# EAGLE schematic nano_control_station (EAGLE 7.4.0)
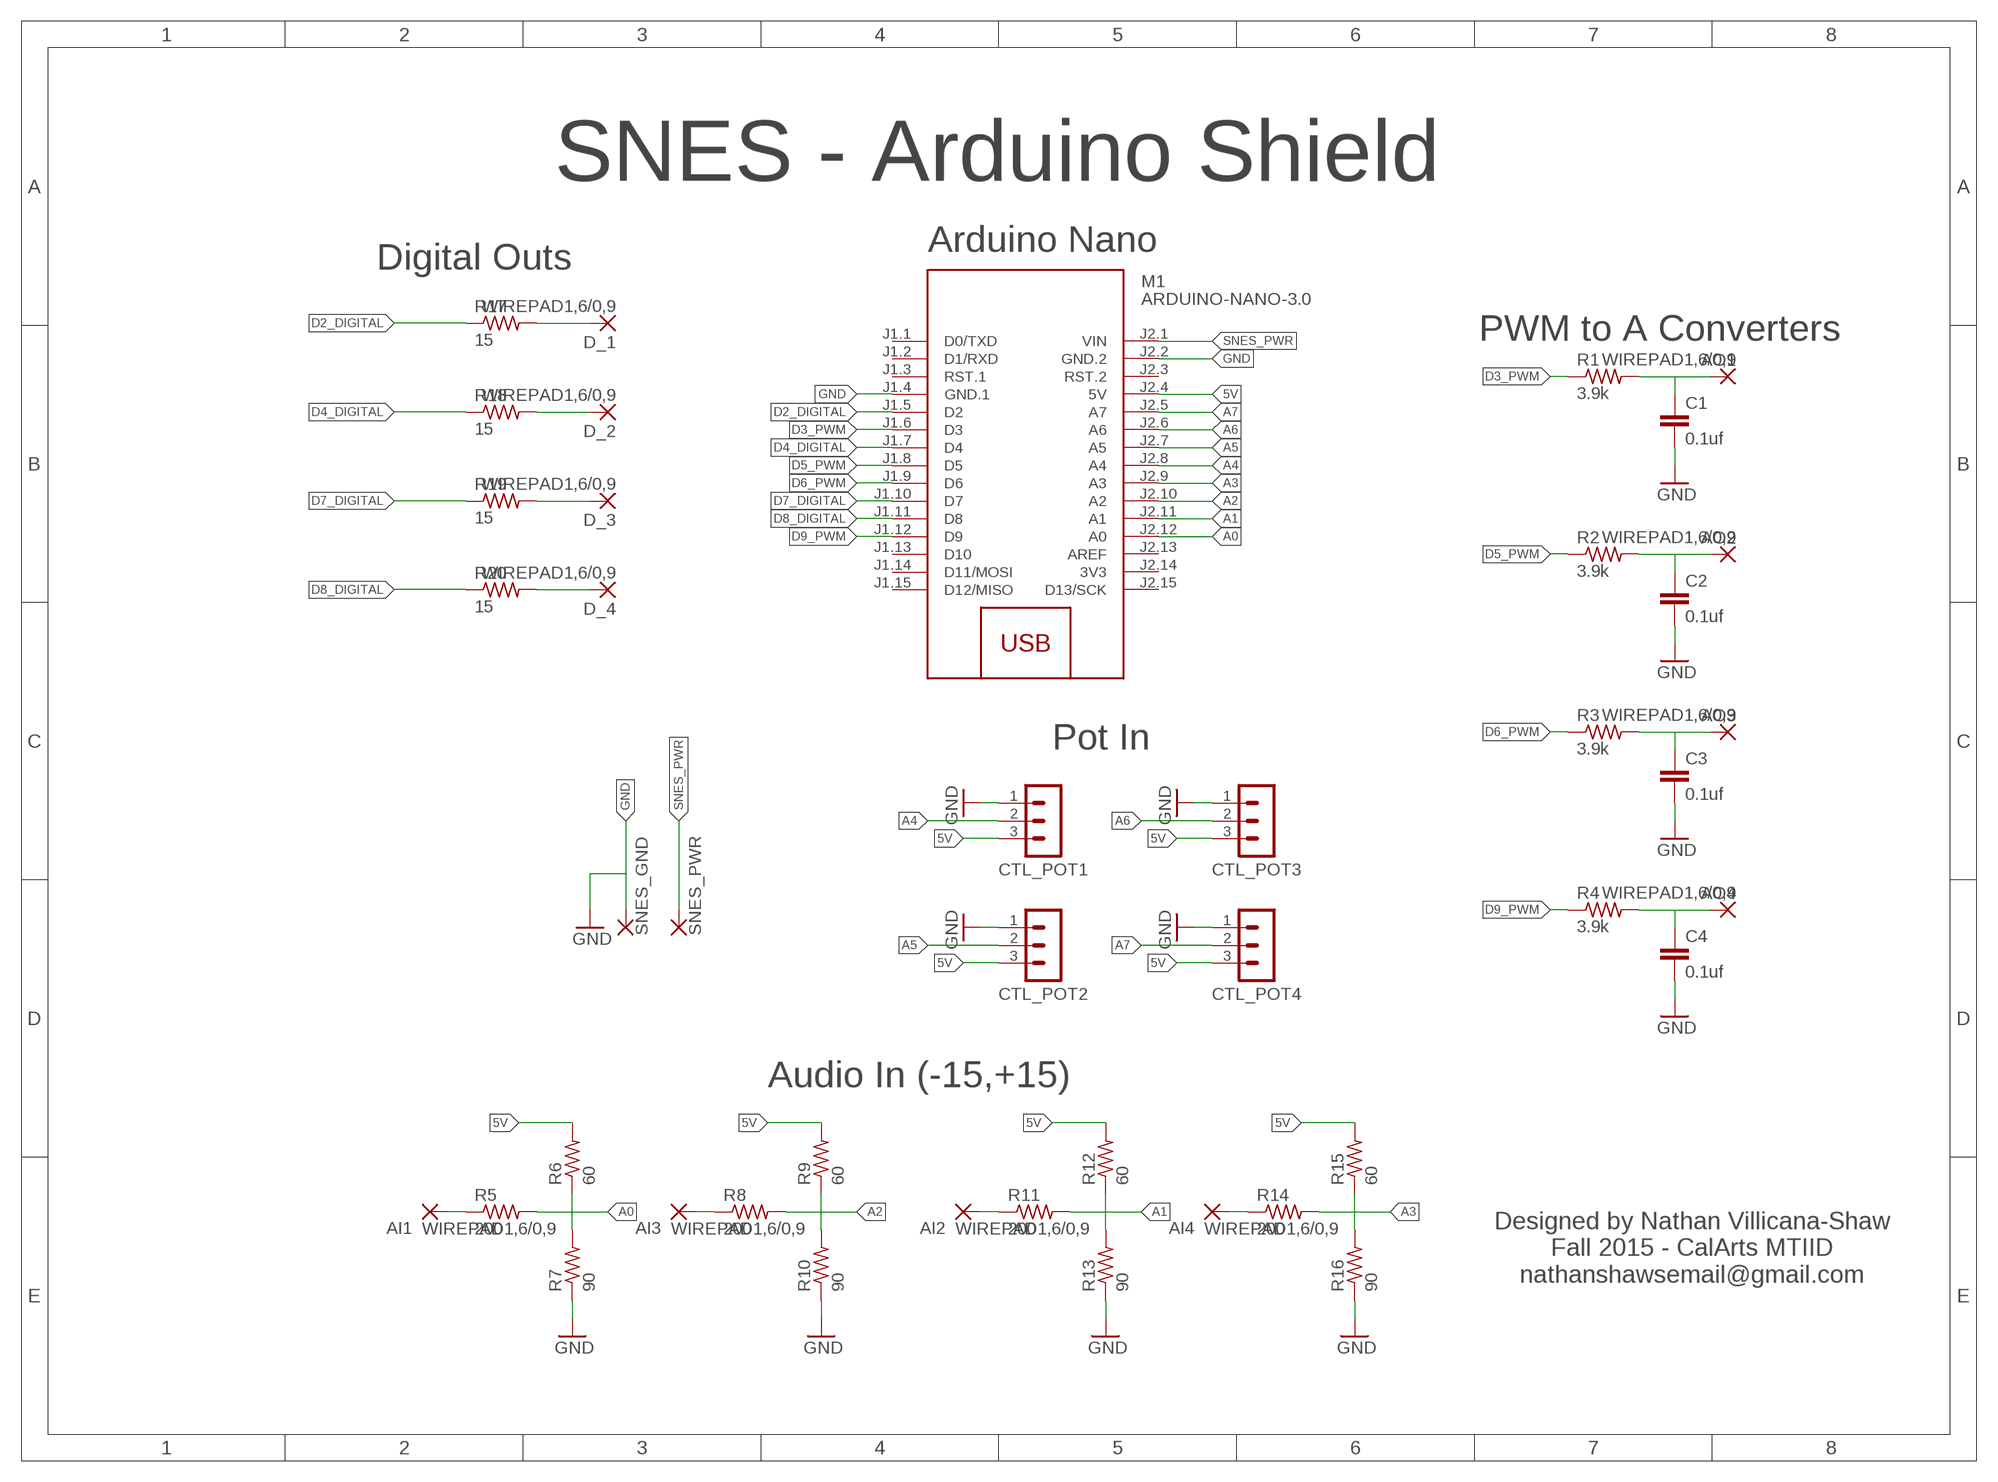
[diagram p0: schematic, sheet 1]

## Parts
AI1  WIREPAD1,6/0,9  [1,6/0,9]
AI2  WIREPAD1,6/0,9  [1,6/0,9]
AI3  WIREPAD1,6/0,9  [1,6/0,9]
AI4  WIREPAD1,6/0,9  [1,6/0,9]
AO1  WIREPAD1,6/0,9  [1,6/0,9]
AO2  WIREPAD1,6/0,9  [1,6/0,9]
AO3  WIREPAD1,6/0,9  [1,6/0,9]
AO4  WIREPAD1,6/0,9  [1,6/0,9]
C1  0.1uf  C2.5/2  [C2.5-2]
C2  0.1uf  C2.5/2  [C2.5-2]
C3  0.1uf  C2.5/2  [C2.5-2]
C4  0.1uf  C2.5/2  [C2.5-2]
CTL_POT1  MA03-1  [MA03-1]
CTL_POT2  MA03-1  [MA03-1]
CTL_POT3  MA03-1  [MA03-1]
CTL_POT4  MA03-1  [MA03-1]
D_1  WIREPAD1,6/0,9  [1,6/0,9]
D_2  WIREPAD1,6/0,9  [1,6/0,9]
D_3  WIREPAD1,6/0,9  [1,6/0,9]
D_4  WIREPAD1,6/0,9  [1,6/0,9]
M1  ARDUINO-NANO-3.0  [ARDUINO-NANO-3.0]
R1  3.9k  R-US_0204/7  [0204/7]
R2  3.9k  R-US_0204/7  [0204/7]
R3  3.9k  R-US_0204/7  [0204/7]
R4  3.9k  R-US_0204/7  [0204/7]
R5  200  R-US_0204/7  [0204/7]
R6  60  R-US_0204/7  [0204/7]
R7  90  R-US_0204/7  [0204/7]
R8  200  R-US_0204/7  [0204/7]
R9  60  R-US_0204/7  [0204/7]
R10  90  R-US_0204/7  [0204/7]
R11  200  R-US_0204/7  [0204/7]
R12  60  R-US_0204/7  [0204/7]
R13  90  R-US_0204/7  [0204/7]
R14  200  R-US_0204/7  [0204/7]
R15  60  R-US_0204/7  [0204/7]
R16  90  R-US_0204/7  [0204/7]
R17  15  R-US_0204/7  [0204/7]
R18  15  R-US_0204/7  [0204/7]
R19  15  R-US_0204/7  [0204/7]
R20  15  R-US_0204/7  [0204/7]
SNES_GND  2,15/1,0  [2,15/1,0]
SNES_PWR  2,15/1,0  [2,15/1,0]

## Nets
5V: CTL_POT1.3 CTL_POT2.3 CTL_POT3.3 CTL_POT4.3 M1.J2.4(5V) R6.2 R9.2 R12.2 R15.2
A0: M1.J2.12(A0) R5.2 R6.1 R7.2
A1: M1.J2.11(A1) R11.2 R12.1 R13.2
A2: M1.J2.10(A2) R8.2 R9.1 R10.2
A3: M1.J2.9(A3) R14.2 R15.1 R16.2
A4: CTL_POT1.2 M1.J2.8(A4)
A5: CTL_POT2.2 M1.J2.7(A5)
A6: CTL_POT3.2 M1.J2.6(A6)
A7: CTL_POT4.2 M1.J2.5(A7)
D2_DIGITAL: M1.J1.5(D2) R17.1
D3_PWM: M1.J1.6(D3) R1.1
D4_DIGITAL: M1.J1.7(D4) R18.1
D5_PWM: M1.J1.8(D5) R2.1
D6_PWM: M1.J1.9(D6) R3.1
D7_DIGITAL: M1.J1.10(D7) R19.1
D8_DIGITAL: M1.J1.11(D8) R20.1
D9_PWM: M1.J1.12(D9) R4.1
GND: C1.2 C2.2 C3.2 C4.2 CTL_POT1.1 CTL_POT2.1 CTL_POT3.1 CTL_POT4.1 M1.J1.4(GND.1) M1.J2.2(GND.2) R7.1 R10.1 R13.1 R16.1 SNES_GND.1(P)
N$1: AI3.1(P) R8.1
N$2: AO1.1(P) C1.1 R1.2
N$3: AO2.1(P) C2.1 R2.2
N$4: AO3.1(P) C3.1 R3.2
N$5: AO4.1(P) C4.1 R4.2
N$6: AI1.1(P) R5.1
N$7: AI2.1(P) R11.1
N$8: AI4.1(P) R14.1
N$9: D_2.1(P) R18.2
N$10: D_1.1(P) R17.2
N$11: D_3.1(P) R19.2
N$12: D_4.1(P) R20.2
SNES_PWR: M1.J2.1(VIN) SNES_PWR.1(P)
Unconnected: M1.J1.1(D0/TXD) M1.J1.2(D1/RXD) M1.J1.3(RST.1) M1.J1.13(D10) M1.J1.14(D11/MOSI) M1.J1.15(D12/MISO) M1.J2.3(RST.2) M1.J2.13(AREF) M1.J2.15(D13/SCK)

## Notes on the sheet
- SNES - Arduino Shield
- Arduino Nano
- Digital Outs
- PWM to A Converters
- Pot In
- Audio In (-15,+15)
- Designed by Nathan Villicana-Shaw
  Fall 2015 - CalArts MTIID
  nathanshawsemail@gmail.com

## Power pins joined to a net without a drawn wire
3V3: M1.J2.14(3V3)

## Library data of the parts
AI1-AI4 AO1-AO4 D_1-D_4 = wirepad:WIREPAD: Wire PAD connect wire on PCB
C1-C4 = capacitor-wima:C: CAPACITOR naming: grid - package width
CTL_POT1-CTL_POT4 = con-lstb:MA03-1: PIN HEADER; OC_FARNELL: unknown; OC_NEWARK: unknown
M1 = diy-modules:ARDUINO-NANO-3.0: Arduino Nano 3.0
R1-R20 = rcl:R-US_: RESISTOR, American symbol
SNES_GND SNES_PWR = wirepad:2,15/1,0: THROUGH-HOLE PAD